# Altium project UWB_kit_prj.PrjPcb
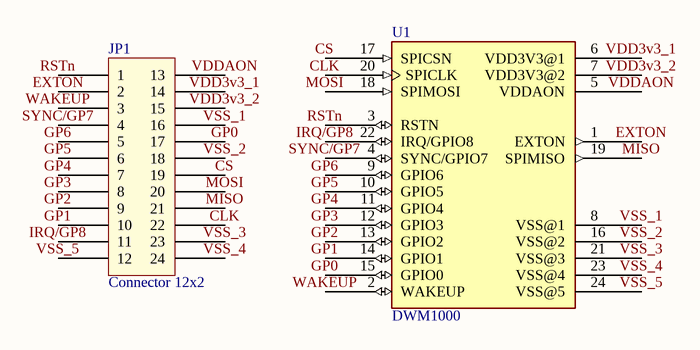
[diagram p0: V2.SchDoc]
1 sheet, 2 parts. Net scope: global (net labels, ports and power ports of the same name join across sheets).
Board file: V2.PcbDoc

## Sheet V2.SchDoc
size A3; SheetNumber: 1; SheetTotal: 1

### Parts
JP1  Connector 12x2  [JP12X2_2]
U1  DWM1000  [XCVR_DWM1000]

### Nets
CLK: JP1.22 U1.20(SPICLK)
CS: JP1.19 U1.17(SPICSN)
EXTON: JP1.2 U1.1(EXTON)
GP0: JP1.17 U1.15(GPIO0)
GP1: JP1.10 U1.14(GPIO1)
GP2: JP1.9 U1.13(GPIO2)
GP3: JP1.8 U1.12(GPIO3)
GP4: JP1.7 U1.11(GPIO4)
GP5: JP1.6 U1.10(GPIO5)
GP6: JP1.5 U1.9(GPIO6)
IRQ/GP8: JP1.11 U1.22(IRQ/GPIO8)
MISO: JP1.21 U1.19(SPIMISO)
MOSI: JP1.20 U1.18(SPIMOSI)
RSTn: JP1.1 U1.3(RSTN)
SYNC/GP7: JP1.4 U1.4(SYNC/GPIO7)
VDD3v3_1: JP1.14 U1.6(VDD3V3@1)
VDD3v3_2: JP1.15 U1.7(VDD3V3@2)
VDDAON: JP1.13 U1.5(VDDAON)
VSS_1: JP1.16 U1.8(VSS@1)
VSS_2: JP1.18 U1.16(VSS@2)
VSS_3: JP1.23 U1.21(VSS@3)
VSS_4: JP1.24 U1.23(VSS@4)
VSS_5: JP1.12 U1.24(VSS@5)
WAKEUP: JP1.3 U1.2(WAKEUP)

### Library data of the parts
JP1 = JP12x2: Value: Connector 12x2
U1 = DWM1000: 802.15.4 IR-UWB Transceiver Module 3.5GHz ~ 6.5GHz Integrated, Chip Surface Mount; MF: Decawave Limited; Package: Module Decawave; Availability: Unavailable; Value: *; MP: DWM1000; SnapEDA_Link: https://www.snapeda.com/parts/DWM1000/Decawave%20Limited/view-part/327593/?ref=snap; Price: None